# EAGLE design transponder_2018_v2 (EAGLE 8.3.1)
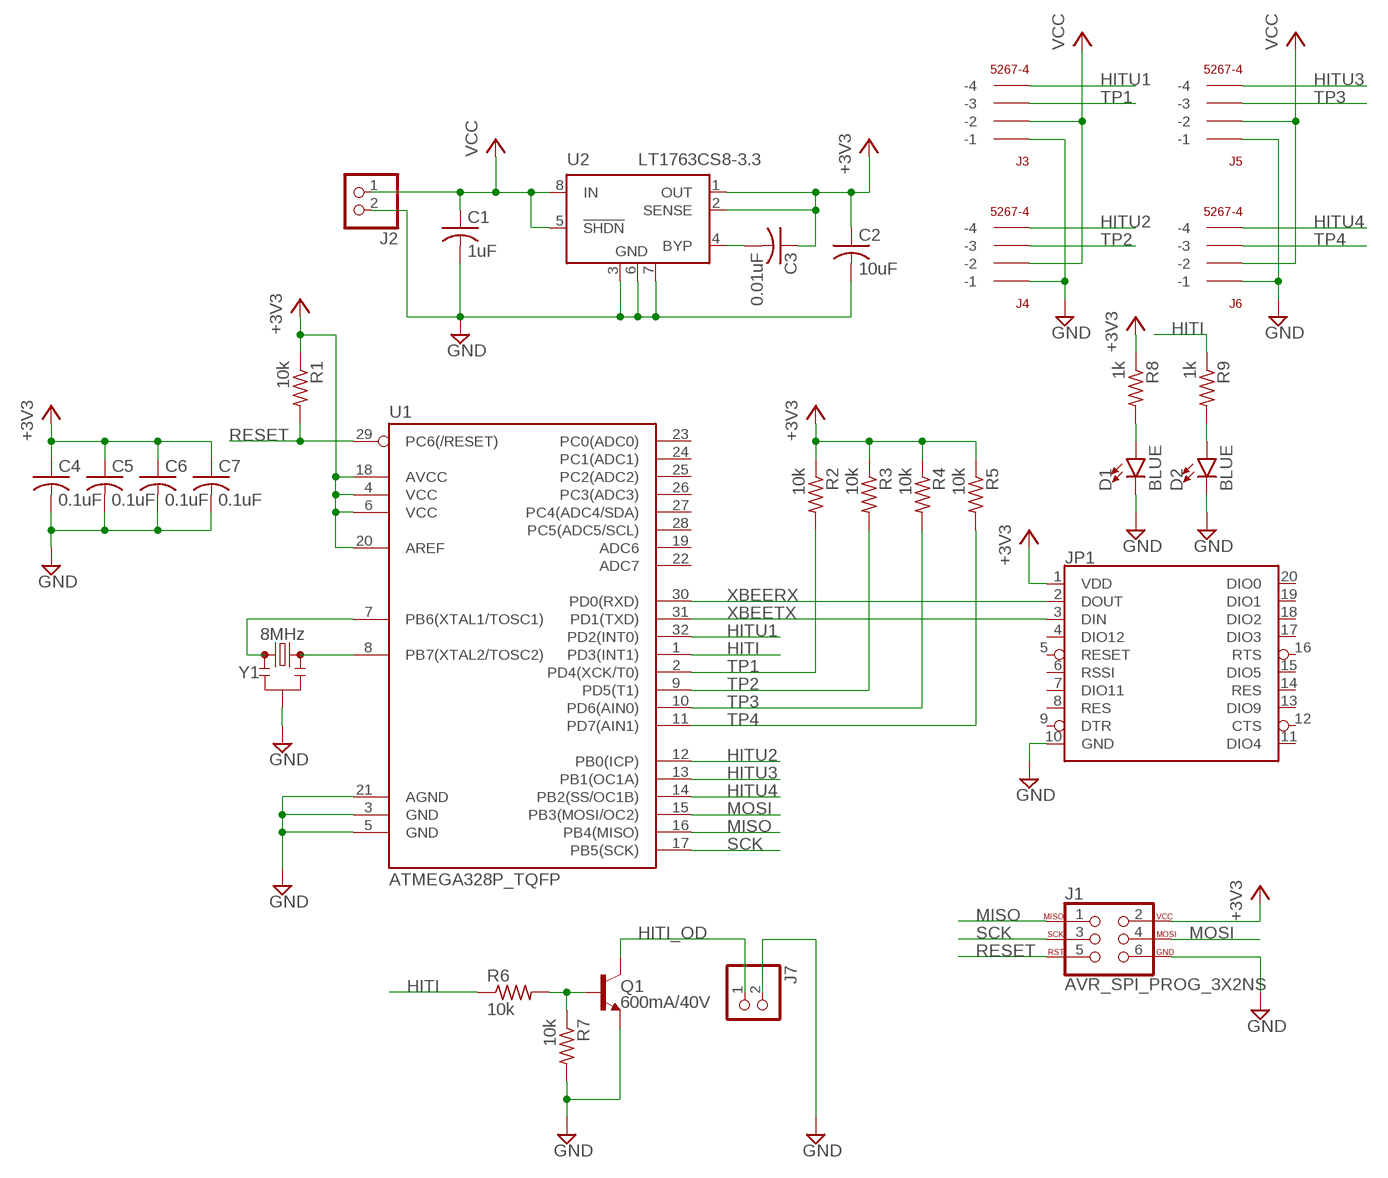
[diagram p0: schematic, sheet 1]

## Parts
C1  1uF  C-USC0603  [C0603]
C2  10uF  C-USC1206  [C1206]
C3  0.01uF  C-USC0603  [C0603]
C4  0.1uF  C-USC0603  [C0603]
C5  0.1uF  C-USC0603  [C0603]
C6  0.1uF  C-USC0603  [C0603]
C7  0.1uF  C-USC0603  [C0603]
D1  BLUE  LED-BLUE0603  [LED-0603]
D2  BLUE  LED-BLUE0603  [LED-0603]
J1  AVR_SPI_PROG_3X2NS  [2X3-NS]
J2  JST_2PIN-THM-RA  [JST-PH-2-THM-RA]
J3  5267-4  [5267-4]
J4  5267-4  [5267-4]
J5  5267-4  [5267-4]
J6  5267-4  [5267-4]
J7  JST_2PIN-THM-RA  [JST-PH-2-THM-RA]
JP1  XBEESMD  [XBEE-SMD]
Q1  600mA/40V  TRANS_NPN-MMBT2222AL  [SOT23-3]
R1  10k  R-US_R0603  [R0603]
R2  10k  R-US_R0603  [R0603]
R3  10k  R-US_R0603  [R0603]
R4  10k  R-US_R0603  [R0603]
R5  10k  R-US_R0603  [R0603]
R6  10k  R-US_R0603  [R0603]
R7  10k  R-US_R0603  [R0603]
R8  1k  R-US_R0603  [R0603]
R9  1k  R-US_R0603  [R0603]
U1  ATMEGA328P_TQFP  [TQFP32-08]
U2  LT1763CS8-3.3  [SOIC8]
Y1  8MHz  RESONATOR-8MHZSMD_3.2X1.3  [RESONATOR-SMD-3.2X1.3]

## Nets
+3V3: C2.1 C3.1 C4.1 C5.1 C6.1 C7.1 J1.2 JP1.1(VDD) R1.1 R2.1 R3.1 R4.1 R5.1 R8.1 U1.4(VCC) U1.6(VCC) U1.18(AVCC) U1.20(AREF) U2.1(OUT) U2.2(SENSE)
GND: C1.2 C2.2 C4.2 C5.2 C6.2 C7.2 D1.C D2.C J1.6 J2.2 J3.P$1(-1) J4.P$1(-1) J5.P$1(-1) J6.P$1(-1) J7.2 JP1.10(GND) Q1.2(E) R7.2 U1.3(GND) U1.5(GND) U1.21(AGND) U2.3(GND) U2.6(GND) U2.7(GND) Y1.2
HITI: R6.1 R9.1 U1.1(PD3(INT1))
HITI_OD: J7.1 Q1.3(C)
HITU1: J3.P$4(-4) U1.32(PD2(INT0))
HITU2: J4.P$4(-4) U1.12(PB0(ICP))
HITU3: J5.P$4(-4) U1.13(PB1(OC1A))
HITU4: J6.P$4(-4) U1.14(PB2(SS/OC1B))
MISO: J1.1 U1.16(PB4(MISO))
MOSI: J1.4 U1.15(PB3(MOSI/OC2))
N$1: U1.8(PB7(XTAL2/TOSC2)) Y1.3
N$2: U1.7(PB6(XTAL1/TOSC1)) Y1.1
N$3: D1.A R8.2
N$4: Q1.1(B) R6.2 R7.1
N$5: D2.A R9.2
N$6: C3.2 U2.4(BYP)
RESET: J1.5 R1.2 U1.29(PC6(/RESET))
SCK: J1.3 U1.17(PB5(SCK))
TP1: J3.P$3(-3) R2.2 U1.2(PD4(XCK/T0))
TP2: J4.P$3(-3) R3.2 U1.9(PD5(T1))
TP3: J5.P$3(-3) R4.2 U1.10(PD6(AIN0))
TP4: J6.P$3(-3) R5.2 U1.11(PD7(AIN1))
VCC: C1.1 J2.1 J3.P$2(-2) J4.P$2(-2) J5.P$2(-2) J6.P$2(-2) U2.5(!SHDN) U2.8(IN)
XBEERX: JP1.2(DOUT) U1.30(PD0(RXD))
XBEETX: JP1.3(DIN) U1.31(PD1(TXD))
Unconnected: JP1.4(DIO12) JP1.5(RESET) JP1.6(RSSI) JP1.7(DIO11) JP1.8(RES) JP1.9(DTR) JP1.11(DIO4) JP1.12(CTS) JP1.13(DIO9) JP1.14(RES) JP1.15(DIO5) JP1.16(RTS) JP1.17(DIO3) JP1.18(DIO2) JP1.19(DIO1) JP1.20(DIO0) U1.19(ADC6) U1.22(ADC7) U1.23(PC0(ADC0)) U1.24(PC1(ADC1)) U1.25(PC2(ADC2)) U1.26(PC3(ADC3)) U1.27(PC4(ADC4/SDA)) U1.28(PC5(ADC5/SCL))

## Library data of the parts
C1-C7 = resistor:C-US: CAPACITOR, American symbol
D1 D2 = SparkFun-LED:LED-BLUE: Blue SMD LED Used in manufacturing of various products at SparkFun Packages: 0603 - SMD 0603 package [Product Link] <http://www.digikey.com/product-detail/en/SMLE12BC7TT86/511-1589-2-ND/1641808> 1206 - SMD1206 package [Product Link] <http://www.digikey.com/product-detail/en/lite-on-inc/LTST-C150TBKT/160-1643-1-ND/573584> SparkFun Products: ESP8266 Thing-Dev Board <https://www.sparkfun.com/products/13711> RedBoard <https://www.sparkfun.com/products/12757>; PROD_ID: DIO-08575
J1 = SparkFun-Connectors:AVR_SPI_PROG_3X2: AVR ISP 6 Pin This is the reduced ISP connector for AVR programming. Common on Arduino. This footprint will take up less PCB space and can be used with a 10-pin to 6-pin adapter such as SKU: BOB-08508 **Special note about "TEST_POINT" package. The stop mask is on the top side, so if you want your programming test points to be on the bottom of your board, make sure to place this package on the bottom side of the board. This also ensure that the orientation to program from the bottom side will be correct. SparkFun Products: SparkFun ISP Pogo Adapter <https://www.sparkfun.com/products/11591> - NS Tiny AVR Programmer <https://www.sparkfun.com/products/11801> -PTH
J2 J7 = adafruit:JST_2PIN: JST 2-Pin Connectors of various flavors SMT-RA (S2B-PH-SM4) 4UConnector #17311 SMT (B2B-PH-SM4) THM-RA (S2B-PH) THM (B2B-PH)
J3-J6 = con-molex-spox:5267-4
JP1 = SparkFun-RF:XBEE: Digi XBee and XBee Pro XBees are tiny blue chips that can communicate wirelessly with each other. They can do simple things, like replacing a couple of wires in serial communication, which is nice when you want to make a remote for your paintball vehicle. SparkFun Products SparkFun XBee Buying Guide <https://www.sparkfun.com/pages/xbee_guide> SparkFun XBee Explorer USB <https://www.sparkfun.com/products/11812> (WRL-11812) Breakout Board for XBee Module <https://www.sparkfun.com/products/8276> (WRL-8276) SparkFun XBee Explorer Regulated <https://www.sparkfun.com/products/11373> (WRL-11373) SparkFun XBee Explorer Dongle <https://www.sparkfun.com/products/11697> (WRL-11697) SparkFun XBee Shield <https://www.sparkfun.com/products/12847> (WRL-12847) SparkFun XBee Explorer Serial <https://www.sparkfun.com/products/13225> (WRL-13225); PROD_ID: CONN-09042
Q1 = SparkFun-DiscreteSemi:TRANS_NPN: NPN transistor Current controlled devices typically used to amplify current or used as a switch. BC547 - COM-08928 <http://www.sparkfun.com/products/8928> (TO-92 45V 100mA) (1.Collector 2.Base 3.Emitter) 2N3904 - COM-00521 <http://www.sparkfun.com/products/521> (TO-92 40V 200mA) (1.Emitter 2.Base 3.Collector) P2N2222A - COM-12852 <http://www.sparkfun.com/products/12852> (TO-92 40V 600mA) (1.Collector 2.Base 3.Emitter); PROD_ID: TRANS-08049
R1-R9 = rcl:R-US_: RESISTOR, American symbol
U1 = SparkFun-IC-Microcontroller:ATMEGA328P_TQFP: Popular 328P in QFP Storefront component: ATmega328 - TQFP <https://www.sparkfun.com/products/13448> (COM-13448) Datasheet <http://www.sparkfun.com/datasheets/Components/SMD/ATMega328.pdf> SparkFun Products SparkFun RedBoard - Programmed with Arduino <https://www.sparkfun.com/products/12757> (DEV-12757) Arduino Pro Mini 328 - 5V/16MHz <https://www.sparkfun.com/products/11113> (DEV-11113) Arduino Pro Mini 328 - 3.3V/8MHz <https://www.sparkfun.com/products/11114> (DEV-11114) SparkFun OpenLog <https://www.sparkfun.com/products/13712> (DEV-13712) SparkFun MicroView - OLED Arduino Module <https://www.sparkfun.com/products/12923> (DEV-12923) SparkFun Digital Sandbox <https://www.sparkfun.com/products/12651> (DEV-12651) SparkFun PicoBoard <https://www.sparkfun.com/products/11888> (WIG-11888) Arduino Fio <https://www.sparkfun.com/products/10116> (DEV-10116) LilyPad Arduino 328 Main Board <https://www.sparkfun.com/products/13342> (DEV-13342) SparkFun RedStick <https://www.sparkfun.com/products/13741> (DEV-13741) LilyPad MP3 <https://www.sparkfun.com/products/11013> (DEV-11013) LilyPad Arduino SimpleSnap <https://www.sparkfun.com/products/10941> (DEV-10941) SparkFun Stepoko <https://www.sparkfun.com/products/13899> (ROB-13899) SparkFun Geiger Counter <https://www.sparkfun.com/products/11345> (SEN-11345) SparkFun EL Sequencer <https://www.sparkfun.com/products/12781> (COM-12781) Arduino Pro 328 - 5V/16MHz <https://www.sparkfun.com/products/10915> (DEV-10915) CryptoCape <https://www.sparkfun.com/products/12773> (DEV-12773) SparkFun IR Thermometer Evaluation Board - MLX90614 <https://www.sparkfun.com/products/10740> (SEN-10740) SparkFun RedBot Mainboard <https://www.sparkfun.com/products/12097> (ROB-12097) Arduino Pro 328 - 3.3V/8MHz <https://www.sparkfun.com/products/10914> (DEV-10914) SparkFun Block for Intel® Edison - Arduino <https://www.sparkfun.com/products/13036> (DEV-13036) SparkFun Simon Says - Surface Mount Soldering Kit <https://www.sparkfun.com/products/10935> (KIT-10935) SparkFun 7-Segment Serial Display - Red <https://www.sparkfun.com/products/11441> (COM-11441) SparkFun 7-Segment Serial Display - White <https://www.sparkfun.com/products/11629> (COM-11629) SparkFun 7-Segment Serial Display - Yellow <https://www.sparkfun.com/products/11443> (COM-11443) SparkFun 7-Segment Serial Display - Kelly Green <https://www.sparkfun.com/products/11440> (COM-11440) SparkFun 7-Segment Serial Display - Blue <https://www.sparkfun.com/products/11442> (COM-11442) SparkFun OpenSegment Serial Display - 20mm (Blue) <https://www.sparkfun.com/products/11647> (COM-11647) SparkFun OpenSegment Serial Display - 20mm (Green) <https://www.sparkfun.com/products/11646> (COM-11646) SparkFun OpenSegment Serial Display - 20mm (White) <https://www.sparkfun.com/products/11648> (COM-11648) SparkFun OpenSegment Serial Display - 20mm (Red) <https://www.sparkfun.com/products/11644> (COM-11644) SparkFun OpenSegment Serial Display - 20mm (Yellow) <https://www.sparkfun.com/products/11645> (COM-11645) SparkFun OpenSegment Shield <https://www.sparkfun.com/products/13190> (DEV-13190); PROD_ID: IC-09069
U2 = linear-technology:LT1763CS8: 500mA, Low Noise, LDO Micropower Regulators Source: http://cds.linear.com/docs/Datasheet/1763ff.pdf; MPN: LT1763CS8-3.3; OC_FARNELL: 1273617; OC_NEWARK: 57M6055
Y1 = SparkFun-Clocks:RESONATOR-8MHZ: 8MHz Resonator Digikey Example <http://www.digikey.com/product-detail/en/murata-electronics-north-america/CSTCE10M0G55-R0/490-1196-1-ND/584633> Frequency: 8MHz Frequency Stability: ±0.2% Frequency Tolerance: ±0.5% Capacitance: 33pF SparkFun Products Arduino Pro Mini 328- 3.3V/8MHz <https://www.sparkfun.com/products/11114> SparkFun Digital Sandbox <https://www.sparkfun.com/products/12651>; PROD_ID: XTAL-08895

## Board
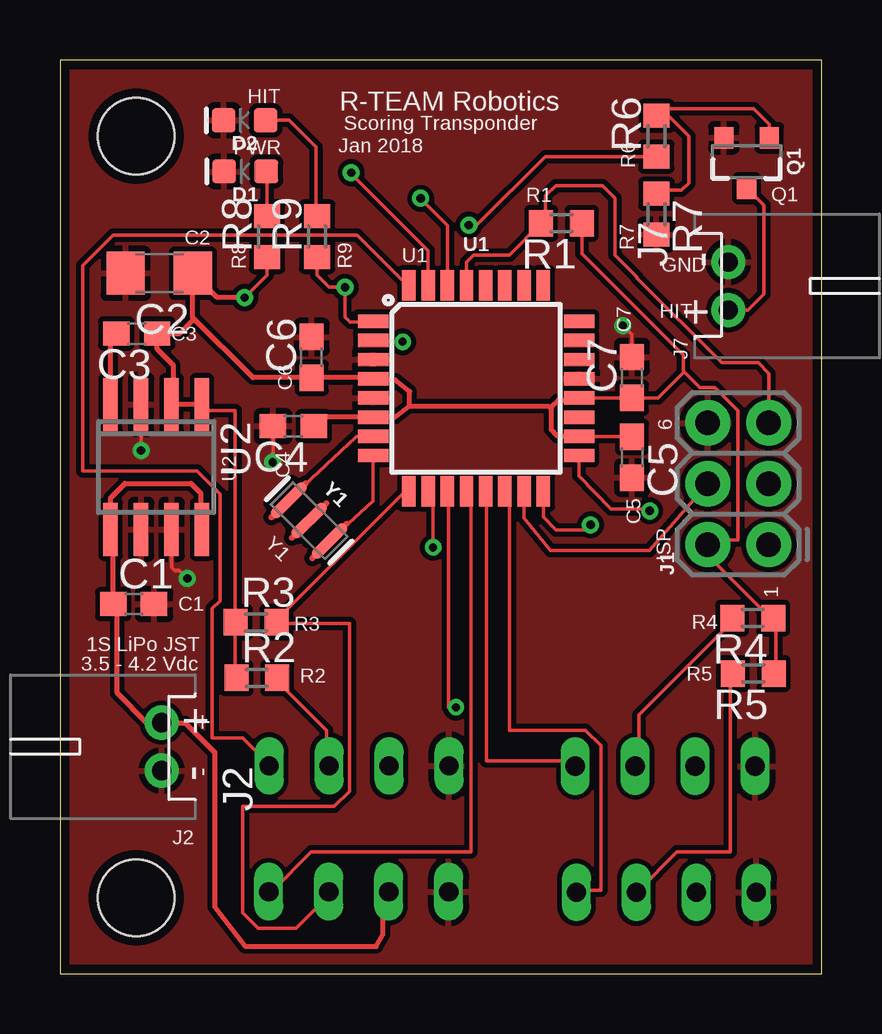
[diagram p1: board, top side]
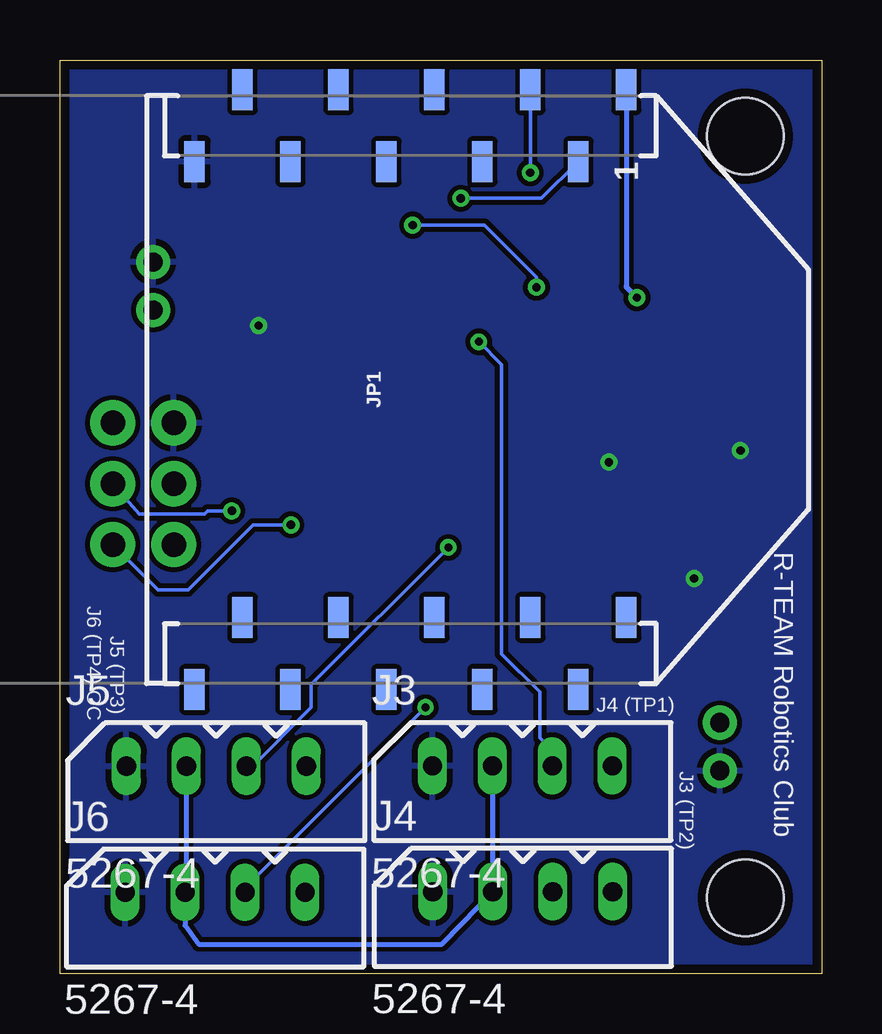
[diagram p2: board, bottom side, seen from below]

Size 31.75 x 38.1 mm. Coordinates in mm from the lower left corner, seen from the top.
Outline: 0,0 31.75,0 31.75,38.1 0,38.1 0,0
Copper layers (1*16): Top 0.0356mm / dielectric 1.5011mm / Bottom 0.0356mm
Design rules "LaenPCBOrder": minimum track width 6mil, minimum drill 13mil, track to track 6mil, track to pad 6mil, pad to pad 6mil, via to via 6mil, smd to smd 6mil, copper to edge 15mil, drill to drill 6mil, minimum pad ring 7mil, minimum via ring 7mil, stop-mask expansion 3mil, vias tented up to drill 0mil, thermal gap 10mil
Holes 3.2 mm at 3.17,3.17 3.17,34.92

### Footprints (pad centres in the part's own frame; a part is rotated, then mirrored left to right if it is on the bottom)
C0603 = smd 1.1 x 1: 1 -0.85,0; 2 0.85,0
C1206 = smd 1.6 x 1.8: 1 -1.4,0; 2 1.4,0
LED-0603 = smd 1 x 1: A -0.877,0; C 0.877,0
2X3-NS = drill 1.016 pad 1.88: 1 -2.54,-1.27; 2 -2.54,1.27; 3 0,-1.27; 4 0,1.27; 5 2.54,-1.27; 6 2.54,1.27
JST-PH-2-THM-RA = drill 0.8 pad 1.422: 1 1,0; 2 -1,0
5267-4 = drill 0.8 long: P$1 0,0; P$2 2.5,0; P$3 5,0; P$4 7.5,0
XBEE-SMD = smd 1.7 x 0.85: 1 -12.5,20; 2 -9.5,18; 3 -12.5,16; 4 -9.5,14; 5 -12.5,12; 6 -9.5,10; 7 -12.5,8; 8 -9.5,6; 9 -12.5,4; 10 -9.5,2; 11 12.5,2; 12 9.5,4; 13 12.5,6; 14 9.5,8; 15 12.5,10; 16 9.5,12; 17 12.5,14; 18 9.5,16; 19 12.5,18; 20 9.5,20
SOT23-3 = smd 0.8 x 0.9: 1 -0.95,-1; 2 0.95,-1; 3 0,1.1
R0603 = smd 1 x 1.1: 1 -0.85,0; 2 0.85,0
TQFP32-08 = smd 1.27 x 0.559: 1 -4.293,2.8; 2 -4.293,2; 3 -4.293,1.2; 4 -4.293,0.4; 5 -4.293,-0.4; 6 -4.293,-1.2; 7 -4.293,-2; 8 -4.293,-2.8; 17 4.293,-2.8; 18 4.293,-2; 19 4.293,-1.2; 20 4.293,-0.4; 21 4.293,0.4; 22 4.293,1.2; 23 4.293,2; 24 4.293,2.8 | smd 0.559 x 1.27: 9 -2.8,-4.293; 10 -2,-4.293; 11 -1.2,-4.293; 12 -0.4,-4.293; 13 0.4,-4.293; 14 1.2,-4.293; 15 2,-4.293; 16 2.8,-4.293; 25 2.8,4.293; 26 2,4.293; 27 1.2,4.293; 28 0.4,4.293; 29 -0.4,4.293; 30 -1.2,4.293; 31 -2,4.293; 32 -2.8,4.293
SOIC8 = smd 0.6 x 2.2: 1 -1.905,-2.6; 2 -0.635,-2.6; 3 0.635,-2.6; 4 1.905,-2.6; 5 1.905,2.6; 6 0.635,2.6; 7 -0.635,2.6; 8 -1.905,2.6
RESONATOR-SMD-3.2X1.3 = smd 0.45 x 1.905: 1 -1.2,0; 2 0,0; 3 1.2,0

### Placement (x,y rotation side)
C1  3.07,15.42 0 top
C2  4.14,29.21 180 top
C3  3.2,26.7 180 top
C4  9.73,22.83 180 top
C5  23.85,21.54 270 top
C6  10.49,25.7 90 top
C7  23.85,24.87 90 top
D1  7.72,33.45 180 top
D2  7.7,35.59 180 top
J1  28.28,20.43 90 top
J2  4.24,9.47 90 top
J3  16.22,8.67 0 bottom
J4  16.21,3.43 0 bottom
J5  28.98,8.66 0 bottom
J6  29.03,3.4 0 bottom
J7  27.86,28.68 270 top
JP1  28.14,24.36 270 bottom
Q1  28.63,33.86 180 top
R1  20.9,31.29 180 top
R2  8.2,12.34 0 top
R3  8.18,14.66 0 top
R4  28.88,14.83 180 top
R5  28.91,12.52 180 top
R6  24.87,34.92 90 top
R7  24.87,31.67 270 top
R8  8.64,30.73 90 top
R9  10.72,30.73 90 top
U1  17.35,24.41 0 top
U2  4.01,21.13 180 top
Y1  10.39,18.9 315 top

### Tracks (layer width: path | path; a pad name or v marks a point on that pad's centre or on a via)
+3V3  (via drill 0.35)
  Top 0.152: R8.1 8.64,29.13 v7.7,28.19 | C5.1 23.83,22.41 U1.18 | C7.1 U1.20 | R1.1 21.75,30.04 25.98,25.81 25.98,25.07 | 24.22,24.03 C7.1 | C7.1 24.93,24.02 25.98,25.07 | 5.95,23.7 U2.1 6.03,23.5 7.3,23.5 7.3,14.92 R3.1 7.3,14.61 7.3,12.38 R2.1 | R5.1 29.84,12.7 29.84,14.61 R4.1 29.53,14.92 27.3,17.14 27.3,17.78 J1.2 27.3,18.1 28.26,18.1 28.26,23.5 27.3,24.45 26.67,24.45 26.04,25.08 25.98,25.07
  Top 0.203: U2.1 U2.2 4.72,23.81 4.72,25.38 4.05,26.05 C3.1 5,26.7 5.54,27.23 5.54,27.36 | 5.54,27.36 C2.1 6.56,28.19 v7.7,28.19 | 14.58,23.67 13.96,23.21 U1.6 10.95,23.21 C4.1 | 14.58,23.67 14.58,24.28 13.97,24.77 13.1,24.77 U1.4 13.01,24.86 C6.1 8.04,24.86 5.54,27.36 | U1.18 20.77,22.41 20.47,22.71 20.47,23.56 | 20.47,23.56 20.47,23.62 20.78,23.93 21.56,23.93 U1.20 | 14.58,23.67 20.36,23.67 20.47,23.56
  Bottom 0.203: JP1.1 8.14,28.69 8.15,28.68 8.15,28.65 v7.7,28.19
GND  (via drill 0.35)
  Top 0.152: U2.7 4.65,16.94 4.78,16.82 4.98,16.82 v5.31,16.48 | C7.2 23.85,26.64 v23.47,27.03 | C4.2 8.88,21.27 8.84,21.23 8.84,21.31 v8.87,21.34 | U2.3 v3.38,21.82
  pour Bottom (isolate 0.203): -0.08,38.13 31.95,38.13 31.95,-0.13 -0.08,-0.13
  pour Top (isolate 0.203): -0.03,38.18 31.9,38.18 31.9,-0.3 -0.03,-0.3
HITI  (via drill 0.35)
  Top 0.152: R6.1 20.23,34.08 17.37,31.22 v17.04,31.22 | U1.1 13.02,27.18 12.09,27.18 11.89,27.38 v11.89,28.63 11.23,28.63 10.72,29.13 R9.1
  Bottom 0.152: v17.04,31.22 14.05,31.22 11.89,29.06 v11.89,28.63
HITI_OD
  Top 0.152: J7.1 28.67,27.68 29.34,28.35 29.34,32.05 Q1.3
HITU1
  Top 0.152: 14.52,28.68 U1.32 14.29,28.89 12.38,30.8 2.22,30.8 0.95,29.53 0.95,20.95 5.71,20.95 6.67,20 6.67,15.56 6.35,15.24 6.35,9.84 7.62,9.84 8.57,8.89 J3.P$4
HITU2
  Top 0.152: U1.12 17.14,20 17.14,5.08 10.48,5.08 8.89,3.49 J4.P$4
HITU3
  Top 0.152: U1.13 17.78,20 17.78,8.89 21.27,8.89 J5.P$4
HITU4
  Top 0.152: U1.14 18.73,20 18.73,10.16 21.91,10.16 22.54,9.53 22.54,3.49 21.59,3.49 J6.P$4
MISO  (via drill 0.35)
  Top 0.152: U1.16 20.15,19.04 20.68,18.52 21.82,18.52 21.84,18.54 21.95,18.54 v22.12,18.72
  Bottom 0.152: v22.12,18.72 23.7,18.72 26.42,16 27.66,16 J1.1
MOSI
  Top 0.152: U1.15 19.35,19.01 20.45,17.65 24.58,17.65 J1.4
N$1
  Top 0.152: U1.8 13.06,19.71 Y1.3
N$2
  Top 0.152: U1.7 12.36,22.41 Y1.1
N$3
  Top 0.152: R8.2 8.64,33.41 D1.A
N$4
  Top 0.152: Q1.1 29.58,35.42 28.93,36.07 25.16,36.07 R6.2 25.36,35.77 26.21,34.92 26.21,32.97 25.91,32.66 25.01,32.66 R7.1
N$5
  Top 0.152: D2.A 9.55,35.59 10.67,34.47 10.67,31.64 R9.2
N$6
  Top 0.203: U2.4 2.11,26.45 C3.2
RESET
  Top 0.152: U1.29 16.95,29.67 17.25,29.97 18.73,29.97 R1.2 20.24,31.48 20.24,32.44 20.68,32.87 22.61,32.87 23.14,32.33 23.14,29.97 24.05,29.06 24.05,29.01 27.58,25.48 29.11,25.48 29.55,25.04 J1.5
SCK  (via drill 0.35)
  Top 0.152: U1.17 21.64,20.75 22.96,19.38 24.51,19.38 v24.59,19.3
  Bottom 0.152: v24.59,19.3 25.6,19.3 25.71,19.16 28.46,19.16 J1.3
TP1  (via drill 0.33)
  Top 0.152: R2.2 9.21,12.06 11.11,10.16 11.11,8.89 J3.P$3 | v14.29,26.35 13.34,26.35 U1.2
  Bottom 0.152: v14.29,26.35 13.34,25.4 13.34,13.34 11.75,11.75 11.75,9.84 11.43,9.53 11.43,8.89 J3.P$3
TP2
  Top 0.152: U1.9 14.29,20 9.21,14.92 R3.2 9.21,14.61 12.06,14.61 12.06,7.62 11.43,6.99 7.62,6.99 7.62,2.54 8.26,1.91 9.84,1.91 11.11,3.17 J4.P$3
TP3  (via drill 0.33)
  Top 0.152: R4.2 27.94,14.61 24.13,10.79 24.13,8.89 J5.P$3 | v15.56,17.78 15.56,20 U1.10
  Bottom 0.152: v15.56,17.78 21.27,12.06 21.27,11.11 23.81,8.57 J5.P$3
TP4  (via drill 0.33)
  Top 0.152: R5.2 27.94,12.38 27.94,5.08 25.72,5.08 24.13,3.49 J6.P$3 | v16.51,11.11 16.19,11.11 16.19,20 U1.11
  Bottom 0.152: v16.51,11.11 23.81,3.81 23.81,3.49 J6.P$3
VCC
  Top 0.203: U2.8 5.87,18.58 5.87,20.04 5.46,20.45 2.72,20.45 2.11,19.84 U2.5 2.22,18.42 C1.1 2.39,15.25 2.39,11.71 3.62,10.47 J2.1 5.22,10.47 6.45,9.25 6.45,2.79 7.72,1.14 13.18,1.14 13.46,1.65 13.46,3.19 J4.P$2
  Bottom 0.203: J3.P$2 13.72,3.45 J4.P$2 14.99,2.1 15.82,1.25 25.96,1.25 26.53,2.02 J6.P$2 26.48,3.45 J5.P$2
XBEERX  (via drill 0.35)
  Top 0.152: U1.30 16.15,31.2 15.14,32.21 15.14,32.23 v15.04,32.33
  Bottom 0.152: v15.04,32.33 11.67,32.33 JP1.2
XBEETX  (via drill 0.35)
  Top 0.152: U1.31 15.35,30.14 12.14,33.35 v12.14,33.4
  Bottom 0.152: v12.14,33.4 JP1.3

### Text on the board
_tsilk: HIT | R-TEAM Robotics | Scoring Transponder | PWR | Jan 2018 | R6 | R1 | Q1 | C2 | R7 | U1 | R8 | R9 | GND | C3 | C7 | HITI | J7 | C6 | 6 | U2 | C4 | C5 | Y1 | ISP | 1 | C1 | R3 | 1S LiPo JST | R4 | 3.5 - 4.2 Vdc | R5 | R2 | + | - | J2
_bsilk: R-TEAM Robotics Club | J6 (TP4) OC | J5 (TP3) | J4 (TP1) | J3 (TP2)